# EAGLE design module_SX1272 (EAGLE 8.4.0)
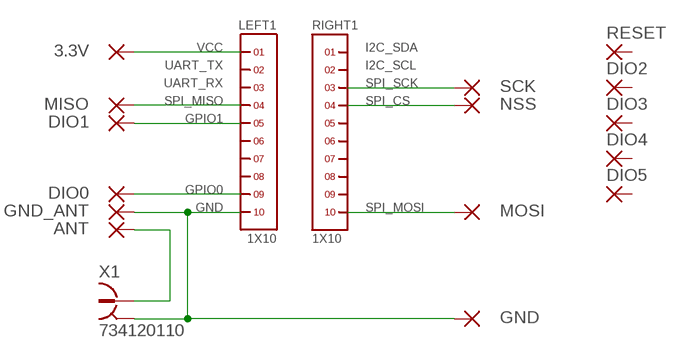
[diagram p0: schematic, sheet 1]

## Parts
3.3V  SMD1  [SMD0,65-1,27]
ANT  SMD1  [SMD0,65-1,27]
DIO0  SMD1  [SMD0,65-1,27]
DIO1  SMD1  [SMD0,65-1,27]
DIO2  SMD1  [SMD0,65-1,27]
DIO3  SMD1  [SMD0,65-1,27]
DIO4  SMD1  [SMD0,65-1,27]
DIO5  SMD1  [SMD0,65-1,27]
GND  SMD1  [SMD0,65-1,27]
GND_ANT  SMD1  [SMD0,65-1,27]
LEFT1  1X10  [1X10]
MISO  SMD1  [SMD0,65-1,27]
MOSI  SMD1  [SMD0,65-1,27]
NSS  SMD1  [SMD0,65-1,27]
RESET  SMD1  [SMD0,65-1,27]
RIGHT1  1X10  [1X10]
SCK  SMD1  [SMD0,65-1,27]
X1  734120110  [734120110]

## Nets
ANT: ANT.1(P) X1.1
GND: GND.1(P) GND_ANT.1(P) LEFT1.10 X1.S@1 X1.S@2 X1.S@3
INT0: DIO0.1(P) LEFT1.9
INT1: DIO1.1(P) LEFT1.5
SPI_CS: NSS.1(P) RIGHT1.4
SPI_MISO: LEFT1.4 MISO.1(P)
SPI_MOSI: MOSI.1(P) RIGHT1.10
SPI_SCK: RIGHT1.3 SCK.1(P)
VCC: 3.3V.1(P) LEFT1.1
Unconnected: DIO2.1(P) DIO3.1(P) DIO4.1(P) DIO5.1(P) LEFT1.2 LEFT1.3 LEFT1.6 LEFT1.7 LEFT1.8 RESET.1(P) RIGHT1.1 RIGHT1.2 RIGHT1.5 RIGHT1.6 RIGHT1.7 RIGHT1.8 RIGHT1.9

## Notes on the sheet
- VCC | I2C_SDA
- UART_TX | I2C_SCL
- UART_RX | SPI_SCK
- SPI_MISO | SPI_CS
- GPIO1
- GPIO0
- GND | SPI_MOSI

## Library data of the parts
3.3V ANT DIO0 DIO1-DIO5 GND GND_ANT MISO MOSI NSS RESET SCK = wirepad:SMD1: SMD PAD
LEFT1 RIGHT1 = headers(2mm):1X10
X1 = con-coax:734120110: MICRO COAXIAL CONNECTOR RECEPTACLE VERTICAL Source: Data sheet <http://www.molex.com/pdm_docs/sd/734120110_sd.pdf>

## Board
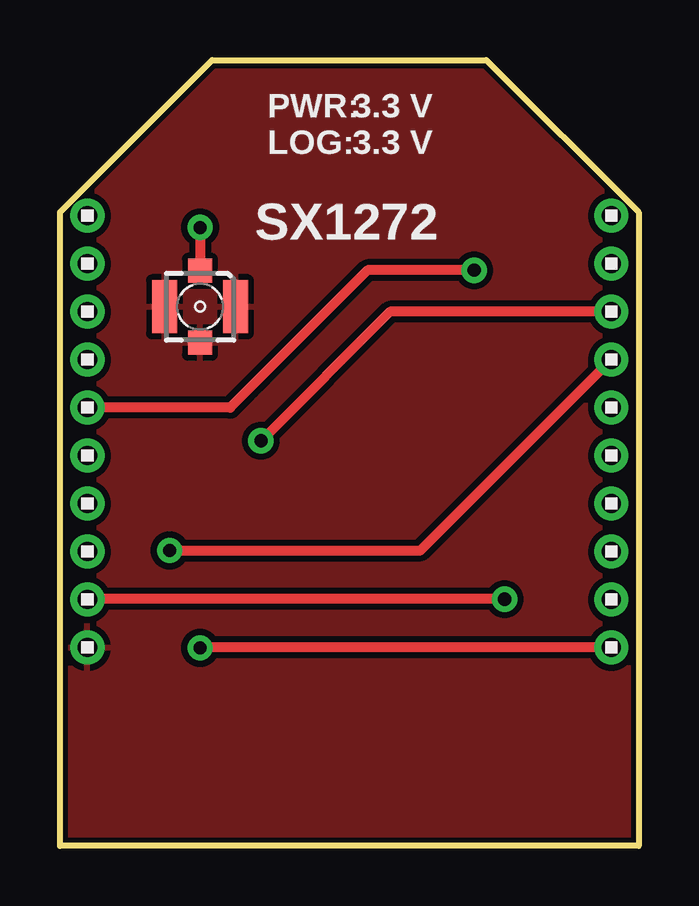
[diagram p1: board, top side]
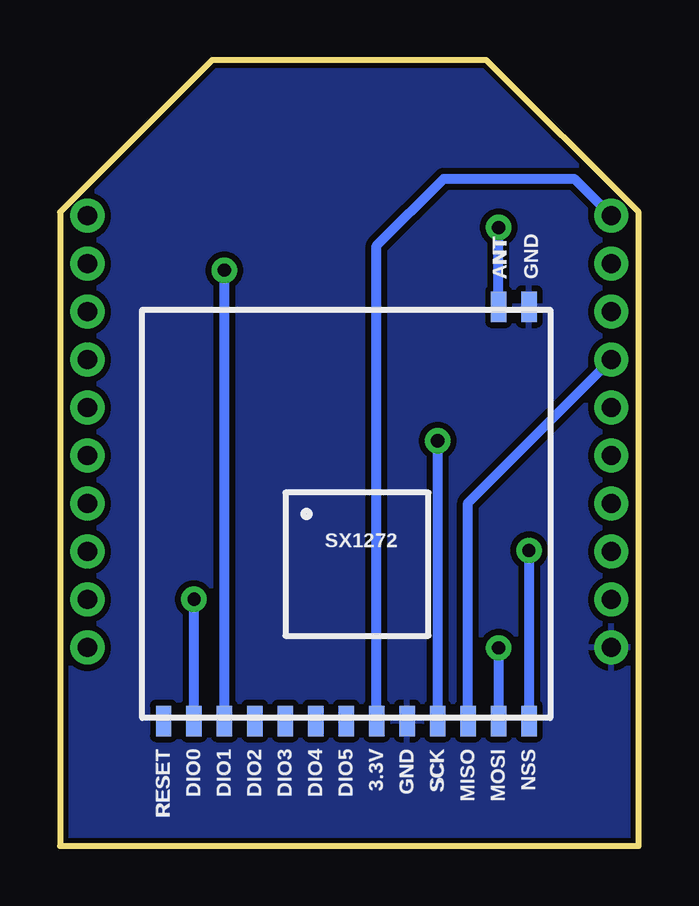
[diagram p2: board, bottom side, seen from below]

Size 24.13 x 32.77 mm. Coordinates in mm from the lower left corner, seen from the top.
Outline: 0,0 0,26.42 6.35,32.77 17.78,32.77 24.13,26.42 24.13,0 0,0
Copper layers (1*16): Top 0.035mm / dielectric 1.5mm / Bottom 0.035mm
Design rules "SparkFun-2-layer-STANDARD": minimum track width 10mil, minimum drill 20mil, track to track 10mil, track to pad 8mil, pad to pad 8mil, via to via 10mil, smd to smd 8mil, copper to edge 8mil, drill to drill 8mil, minimum pad ring 10mil, minimum via ring 10mil, stop-mask expansion 4mil, vias tented up to drill 25mil, thermal gap 10mil

### Footprints (pad centres in the part's own frame; a part is rotated, then mirrored left to right if it is on the bottom)
SMD0,65-1,27 = smd 0.635 x 1.27: 1 0,0
1X10 = drill 0.8 pad 1.422: 1 -9,0; 2 -7,0; 3 -5,0; 4 -3,0; 5 -1,0; 6 1,0; 7 3,0; 8 5,0; 9 7,0; 10 9,0
734120110 = smd 1 x 1: 1 0,-1.5; S@1 0,1.5 | smd 1.05 x 2.2: S@2 -1.475,0; S@3 1.475,0

### Placement (x,y rotation side)
3.3V  10.92,5.21 180 bottom
ANT  5.84,22.48 180 bottom
DIO0  18.54,5.21 180 bottom
DIO1  17.27,5.21 180 bottom
DIO2  16,5.21 180 bottom
DIO3  14.73,5.21 180 bottom
DIO4  13.46,5.21 180 bottom
DIO5  12.19,5.21 0 bottom
GND  9.65,5.21 180 bottom
GND_ANT  4.57,22.48 180 bottom
LEFT1  1.14,17.27 270 top
MISO  7.11,5.21 180 bottom
MOSI  5.84,5.21 180 bottom
NSS  4.57,5.21 180 bottom
RESET  19.81,5.21 180 bottom
RIGHT1  22.99,17.27 270 top
SCK  8.38,5.21 180 bottom
X1  5.84,22.48 180 top

### Tracks (layer width: path | path; a pad name or v marks a point on that pad's centre or on a via)
ANT  (via drill 0.55)
  Top 0.406: v5.84,25.78 X1.1
  Bottom 0.406: ANT.1 v5.84,25.78
GND
  pour Bottom: -0.51,-0.51 -0.51,26.67 6.1,33.27 18.03,33.27 24.64,26.67 24.64,-0.51
  pour Top: -0.25,-0.25 -0.25,26.54 6.22,33.02 17.91,33.02 24.38,26.54 24.38,-0.25
INT0  (via drill 0.55)
  Top 0.406: v18.54,10.29 1.16,10.29 LEFT1.9
  Bottom 0.406: DIO0.1 v18.54,10.29
INT1  (via drill 0.55)
  Top 0.406: v17.27,24 12.83,24 7.1,18.27 LEFT1.5
  Bottom 0.406: DIO1.1 v17.27,24
SPI_CS  (via drill 0.55)
  Top 0.406: v4.57,12.32 15.03,12.32 RIGHT1.4
  Bottom 0.406: v4.57,12.32 NSS.1
SPI_MISO
  Bottom 0.406: MISO.1 7.11,14.3 LEFT1.4
SPI_MOSI  (via drill 0.55)
  Top 0.406: RIGHT1.10 5.86,8.27 v5.84,8.25
  Bottom 0.406: v5.84,8.25 MOSI.1
SPI_SCK  (via drill 0.55)
  Top 0.406: RIGHT1.3 13.76,22.27 v8.38,16.89
  Bottom 0.406: v8.38,16.89 SCK.1
VCC
  Bottom 0.406: 3.3V.1 10.92,25.02 8.13,27.81 2.68,27.81 LEFT1.1

### Text on the board
_tNames: PWR: / LOG: | 3.3 V / 3.3 V | SX1272
_bNames: GND | ANT | SX1272 | NSS | MOSI | MISO | SCK | GND | 3.3V | DIO5 | DIO4 | DIO3 | DIO2 | DIO1 | DIO0 | RESET